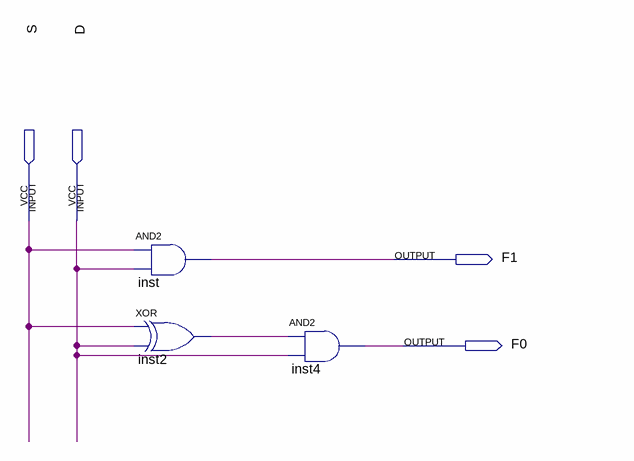
[diagram p0: schematic sheet]
// Quartus schematic ex1-4.bdf as structural Verilog: 3 symbols, 4 pins
module \ex1-4  (
  input  S,
  input  D,
  output F1,
  output F0
);

  wire inst2_out;

  and inst (F1, S, D);
  xor inst2 (inst2_out, S, D);
  and inst4 (F0, inst2_out, D);
endmodule
